# EAGLE design AVEFlex (EAGLE 9.6.2)
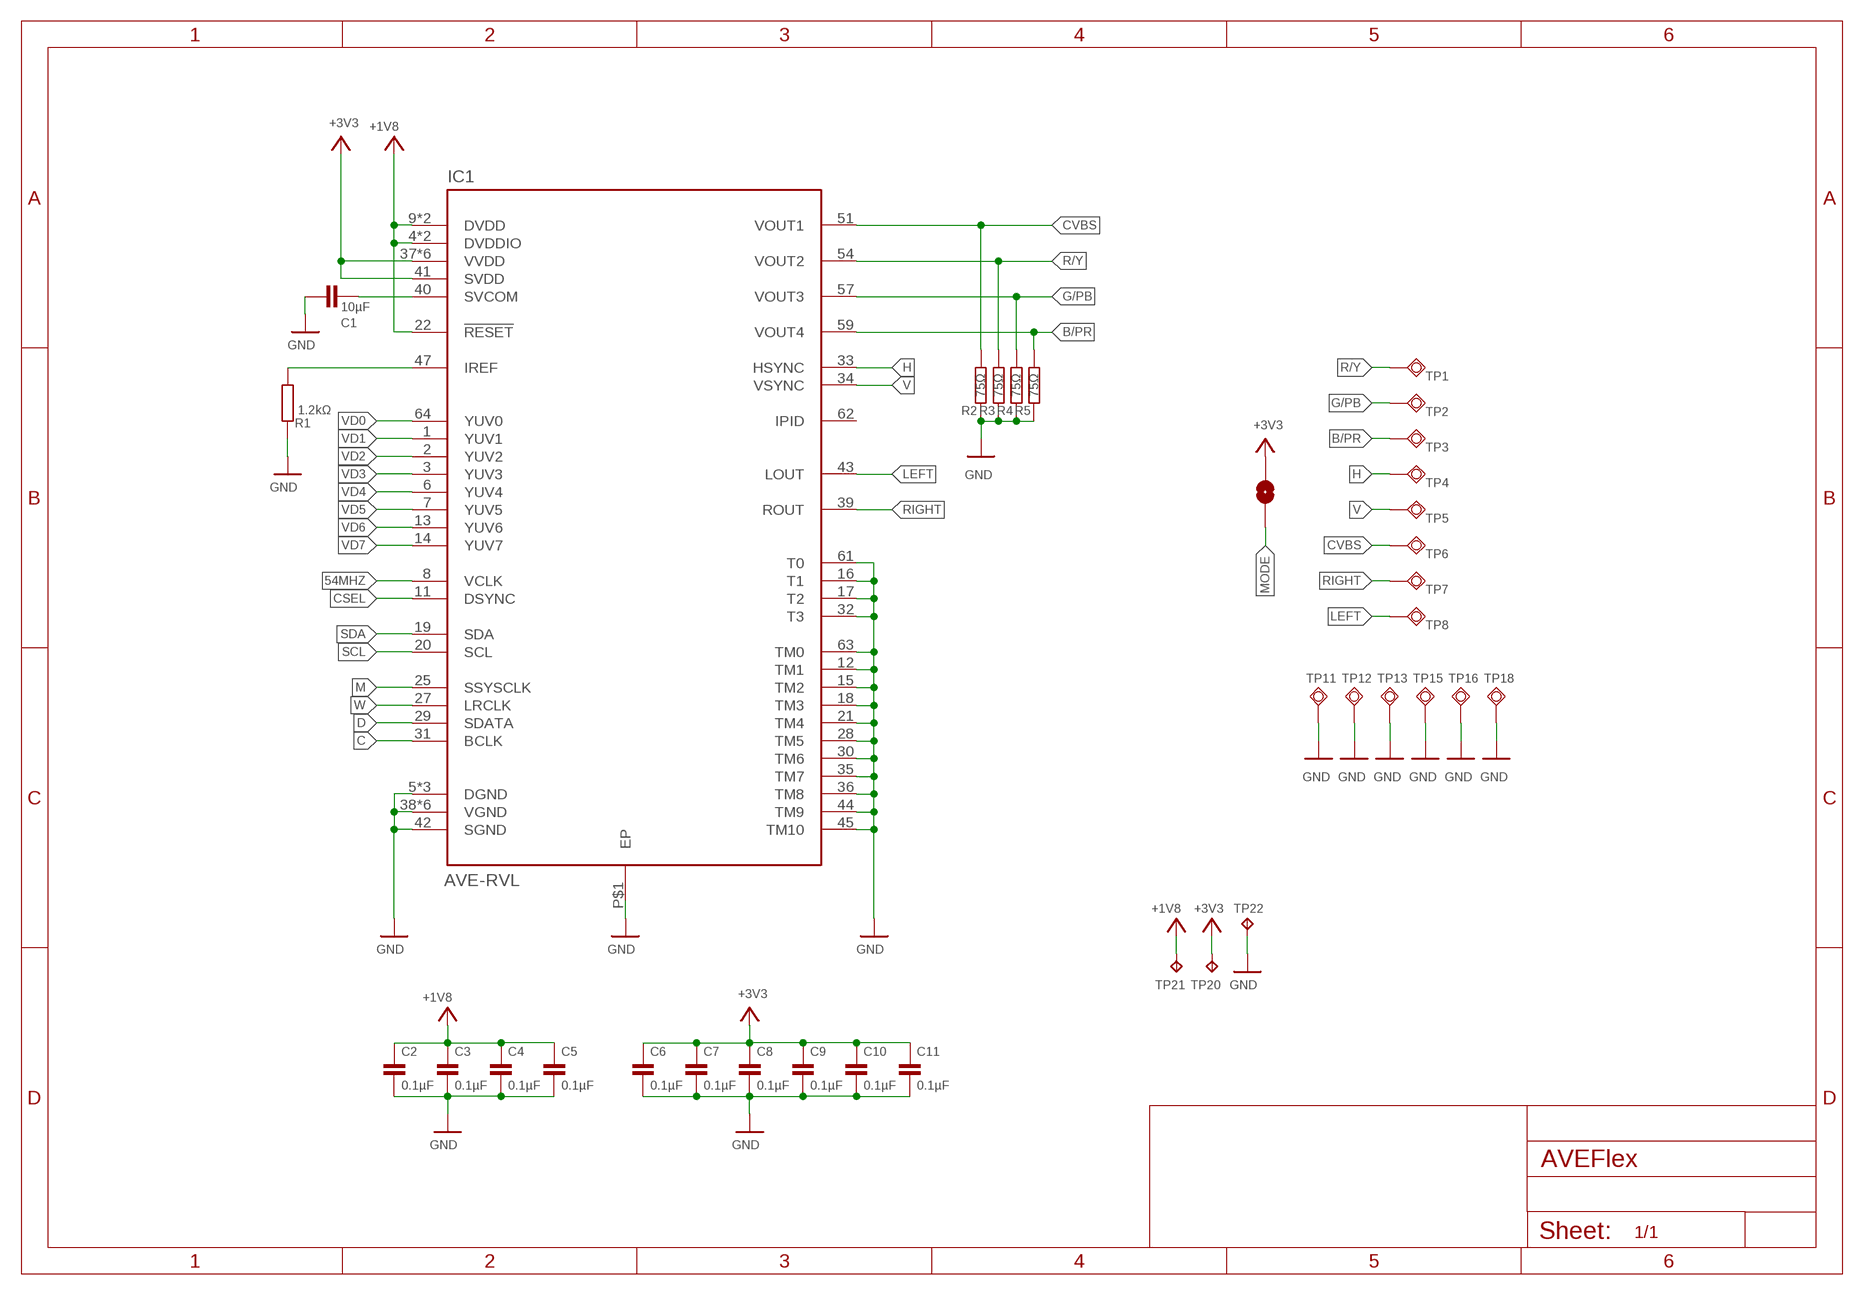
[diagram p0: schematic, sheet 1]

## Parts
C1  10µF  C-USC0603  [C0603]
C2  0.1µF  C-USC0402  [C0402]
C3  0.1µF  C-USC0402  [C0402]
C4  0.1µF  C-USC0402  [C0402]
C5  0.1µF  C-USC0402  [C0402]
C6  0.1µF  C-USC0402  [C0402]
C7  0.1µF  C-USC0402  [C0402]
C8  0.1µF  C-USC0402  [C0402]
C9  0.1µF  C-USC0402  [C0402]
C10  0.1µF  C-USC0402  [C0402]
C11  0.1µF  C-USC0402  [C0402]
IC1  AVE-RVL  AVE  [TQFP64-10X10]
JP1  JUMPER-SMT_2_NO_SILK  [SMT-JUMPER_2_NO_SILK]
R1  1.2kΩ  R-US_R0402  [R0402]
R2  75Ω  R-US_R0402  [R0402]
R3  75Ω  R-US_R0402  [R0402]
R4  75Ω  R-US_R0402  [R0402]
R5  75Ω  R-US_R0402  [R0402]
TP1  TPSQTP10R  [TP10R]
TP2  TPSQTP10R  [TP10R]
TP3  TPSQTP10R  [TP10R]
TP4  TPSQTP10R  [TP10R]
TP5  TPSQTP10R  [TP10R]
TP6  TPSQTP10R  [TP10R]
TP7  TPSQTP10R  [TP10R]
TP8  TPSQTP10R  [TP10R]
TP11  TPSQTP10R  [TP10R]
TP12  TPSQTP10R  [TP10R]
TP13  TPSQTP10R  [TP10R]
TP15  TPSQTP10R  [TP10R]
TP16  TPSQTP10R  [TP10R]
TP18  TPSQTP10R  [TP10R]
TP20  TPTP10SQ  [TP10SQ]
TP21  TPTP10SQ  [TP10SQ]
TP22  TPTP10SQ  [TP10SQ]

## Nets
54MHZ: IC1.8(VCLK)
+1V8: C2.1 C3.1 C4.1 C5.1 IC1.4(DVDDIO) IC1.9(DVDD) IC1.22(!RESET) IC1.23(DVDD) IC1.26(DVDDIO) TP21.TP
+3V3: C6.1 C7.1 C8.1 C9.1 C10.1 C11.1 IC1.37(VVDD) IC1.41(SVDD) IC1.46(VVDD) IC1.50(VVDD) IC1.53(VVDD) IC1.56(VVDD) IC1.60(VVDD) JP1.2 TP20.TP
B/PR: IC1.59(VOUT4) R5.1 TP3.TP
C: IC1.31(BCLK)
CSEL: IC1.11(DSYNC)
CVBS: IC1.51(VOUT1) R2.1 TP6.TP
D: IC1.29(SDATA)
G/PB: IC1.57(VOUT3) R4.1 TP2.TP
GND: C1.2 C2.2 C3.2 C4.2 C5.2 C6.2 C7.2 C8.2 C9.2 C10.2 C11.2 IC1.5(DGND) IC1.10(DGND) IC1.12(TM1) IC1.15(TM2) IC1.16(T1) IC1.17(T2) IC1.18(TM3) IC1.21(TM4) IC1.24(DGND) IC1.28(TM5) IC1.30(TM6) IC1.32(T3) IC1.35(TM7) IC1.36(TM8) IC1.38(VGND) IC1.42(SGND) IC1.44(TM9) IC1.45(TM10) IC1.48(VGND) IC1.49(VGND) IC1.52(VGND) IC1.55(VGND) IC1.58(VGND) IC1.61(T0) IC1.63(TM0) IC1.P$1(EP) R1.2 R2.2 R3.2 R4.2 R5.2 TP11.TP TP12.TP TP13.TP TP15.TP TP16.TP TP18.TP TP22.TP
H: IC1.33(HSYNC) TP4.TP
IREF: IC1.47(IREF) R1.1
LEFT: IC1.43(LOUT) TP8.TP
M: IC1.25(SSYSCLK)
MODE: JP1.1
N$5: C1.1 IC1.40(SVCOM)
R/Y: IC1.54(VOUT2) R3.1 TP1.TP
RIGHT: IC1.39(ROUT) TP7.TP
SCL: IC1.20(SCL)
SDA: IC1.19(SDA)
V: IC1.34(VSYNC) TP5.TP
VD0: IC1.64(YUV0)
VD1: IC1.1(YUV1)
VD2: IC1.2(YUV2)
VD3: IC1.3(YUV3)
VD4: IC1.6(YUV4)
VD5: IC1.7(YUV5)
VD6: IC1.13(YUV6)
VD7: IC1.14(YUV7)
W: IC1.27(LRCLK)
Unconnected: IC1.62(IPID)

## Library data of the parts
C1-C11 = resistor:C-US: CAPACITOR, American symbol
IC1 = ave:AVE
JP1 = SparkFun-Jumpers:JUMPER-SMT_2_NO: Normally open jumper This jumper has two pads in close proximity to each other. Apply solder to close the connection. Round pads are easier to solder for beginners, but are a lot larger. SparkFun Product that uses the round pads: SparkFun EL Sequencer <https://www.sparkfun.com/products/12781>
R1-R5 = resistor:R-US_: RESISTOR, American symbol
TP1-TP8 TP11-TP13 TP15 TP16 TP18 = testpad:TPSQ: Test pad
TP20-TP22 = BeagleBone_Blue_R3:TP: Test pad

## Board
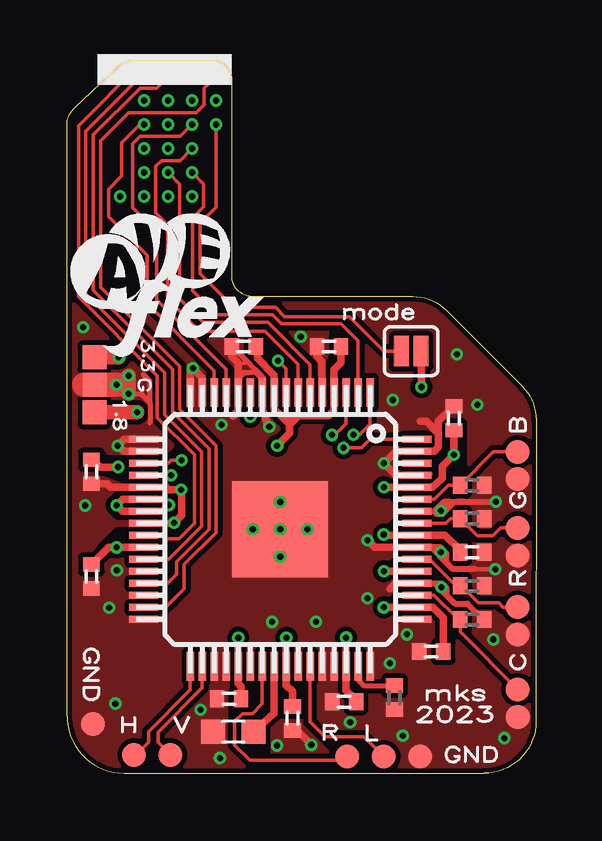
[diagram p1: board, top side]
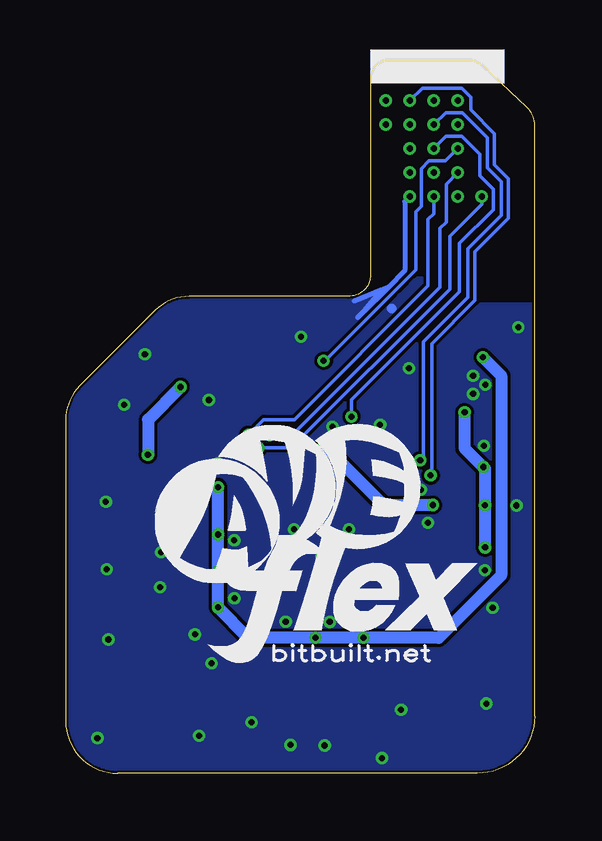
[diagram p2: board, bottom side, seen from below]

Size 19.56 x 29.72 mm. Coordinates in mm from the lower left corner, seen from the top.
Outline: 0,27 arc-47 0.31,27.73
Outline: 2.12,29.44 arc-43 2.81,29.72
Outline: 6.06,29.72 arc-90 6.86,28.92
Outline: 6.86,20.68 arc45 7.07,20.16
Outline: 7.07,20.16 arc45 7.78,19.87
Outline: 14.41,19.87 arc-45 15.83,19.28
Outline: 18.97,16.14 arc-45 19.56,14.72
Outline: 19.56,2.17 arc-90 17.39,0
Outline: 0,2.38 arc90 2.38,0
Outline: 0,27 arc-47 0.31,27.73
Outline: 0.31,27.73 2.12,29.44
Outline: 2.12,29.44 arc-43 2.81,29.72
Outline: 2.81,29.72 6.06,29.72
Outline: 6.06,29.72 arc-90 6.86,28.92
Outline: 6.86,28.92 6.86,23.3 6.86,20.68
Outline: 6.86,20.68 arc45 7.07,20.16
Outline: 7.07,20.16 arc45 7.78,19.87
Outline: 7.78,19.87 14.41,19.87
Outline: 14.41,19.87 arc-45 15.83,19.28
Outline: 15.83,19.28 18.97,16.14
Outline: 18.97,16.14 arc-45 19.56,14.72
Outline: 19.56,14.72 19.56,2.17
Outline: 19.56,2.17 arc-90 17.39,0
Outline: 0,2.38 0,27
Outline: 0,2.38 arc90 2.38,0
Outline: 2.38,0 17.39,0
Copper layers (1*16): Top 0.035mm / dielectric 0.065mm / Bottom 0.035mm
Design rules "default *": minimum track width 6mil, minimum drill 10mil, track to track 5mil, track to pad 5mil, pad to pad 5mil, via to via 5mil, smd to smd 5mil, copper to edge 4mil, drill to drill 5mil, minimum pad ring 4mil, minimum via ring 4mil, stop-mask expansion 0mil, vias tented up to drill 30mil, thermal gap 10mil
tRestrict: area 3.6,9.8 to 5.6,12.6; area 3.3,7.1 to 4.4,8.9; area 7.1,3.5 to 10,4.2; area 14.7,12.9 to 15.9,14.1; area 15,7 to 16.5,12.1; 32 lines

### Footprints (pad centres in the part's own frame; a part is rotated, then mirrored left to right if it is on the bottom)
C0603 = smd 1 x 1: 1 -0.85,0; 2 0.85,0
C0402 = smd 0.6 x 0.7: 1 -0.5,0; 2 0.5,0
TQFP64-10X10 = smd 1.2 x 0.3: 1 -5.7,3.75; 2 -5.7,3.25; 3 -5.7,2.75; 4 -5.7,2.25; 5 -5.7,1.75; 6 -5.7,1.25; 7 -5.7,0.75; 8 -5.7,0.25; 9 -5.7,-0.25; 10 -5.7,-0.75; 11 -5.7,-1.25; 12 -5.7,-1.75; 13 -5.7,-2.25; 14 -5.7,-2.75; 15 -5.7,-3.25; 16 -5.7,-3.75; 33 5.7,-3.75; 34 5.7,-3.25; 35 5.7,-2.75; 36 5.7,-2.25; 37 5.7,-1.75; 38 5.7,-1.25; 39 5.7,-0.75; 40 5.7,-0.25; 41 5.7,0.25; 42 5.7,0.75; 43 5.7,1.25; 44 5.7,1.75; 45 5.7,2.25; 46 5.7,2.75; 47 5.7,3.25; 48 5.7,3.75 | smd 0.3 x 1.2: 17 -3.75,-5.7; 18 -3.25,-5.7; 19 -2.75,-5.7; 20 -2.25,-5.7; 21 -1.75,-5.7; 22 -1.25,-5.7; 23 -0.75,-5.7; 24 -0.25,-5.7; 25 0.25,-5.7; 26 0.75,-5.7; 27 1.25,-5.7; 28 1.75,-5.7; 29 2.25,-5.7; 30 2.75,-5.7; 31 3.25,-5.7; 32 3.75,-5.7; 49 3.75,5.7; 50 3.25,5.7; 51 2.75,5.7; 52 2.25,5.7; 53 1.75,5.7; 54 1.25,5.7; 55 0.75,5.7; 56 0.25,5.7; 57 -0.25,5.7; 58 -0.75,5.7; 59 -1.25,5.7; 60 -1.75,5.7; 61 -2.25,5.7; 62 -2.75,5.7; 63 -3.25,5.7; 64 -3.75,5.7 | smd 4 x 4: P$1 0,0
SMT-JUMPER_2_NO_SILK = smd 0.635 x 1.27: 1 -0.406,0; 2 0.406,0
R0402 = smd 0.6 x 0.7: 1 -0.5,0; 2 0.5,0
TP10R = smd 1 x 1: TP 0,0
TP10SQ = smd 1 x 1: TP 0,0

### Placement (x,y rotation side)
C1  6.93,1.73 180 top
C2  10.92,17.78 180 top
C3  7.37,17.78 180 top
C4  1.02,12.56 270 top
C5  1.02,8.2 270 top
C6  6.76,3.1 180 top
C7  9.4,2.29 270 top
C8  11.55,2.98 180 top
C9  15.19,5.07 180 top
C10  16.89,9.2 0 top
C11  16.13,14.79 90 top
IC1  8.89,10.16 270 top
JP1  14.35,17.58 0 top
R1  13.65,3.15 270 top
R2  16.89,6.41 0 top
R3  16.89,7.81 0 top
R4  16.89,10.6 0 top
R5  16.89,12 0 top
TP1  18.8,6.92 0 top
TP2  18.8,10.22 0 top
TP3  18.8,13.39 0 top
TP4  2.79,0.76 0 top
TP5  4.32,0.76 0 top
TP6  18.8,3.49 0 top
TP7  11.69,0.69 0 top
TP8  13.21,0.69 0 top
TP11  18.8,5.77 0 top
TP12  18.8,9.08 0 top
TP13  18.8,12.25 0 top
TP15  1.08,2.06 0 top
TP16  14.73,0.69 0 top
TP18  18.8,2.34 315 top
TP20  1.14,17.33 0 top
TP21  1.14,15.04 0 top
TP22  1.14,16.19 0 top

### Tracks (layer width: path | path; a pad name or v marks a point on that pad's centre or on a via)
54MHZ  (via drill 0.25 pad 0.51)
  Top 0.152: v8.8,17.18 9.14,16.85 IC1.8
  Bottom 0.152: v3.21,26.03 3.73,25.51 4.41,25.51 4.73,25.2 4.73,23.63 4.96,23.4 4.96,20.97 8.75,17.18 v8.8,17.18
+1V8  (via drill 0.25 pad 0.51)
  Top 0.152: IC1.26
  Top 0.305: C2.1 11.43,17.77 11.43,17.11 11.14,16.82 IC1.4 11.14,15.13 10.9,14.9 9.65,14.9 | C3.1 7.94,17.7 7.94,17.28 8.64,16.59 IC1.9 8.64,15.17 8.91,14.9 | C4.1 1.08,13.06 1.39,12.76 v2.14,12.76 | IC1.26 2.15,9.41 2.11,9.37 v2.07,9.41 1.73,9.41 C5.1 | C5.1 | 9.65,14.9 8.91,14.9 | 8.91,14.9 8.91,14.89 9.27,14.54 | 9.27,14.54 9.27,14.16 v8.76,13.65 | 9.27,14.54 9.29,14.54 9.65,14.9 | IC1.22 2.32,11.41 v2.07,11.16 2.32,10.91 IC1.23 3.98,10.91 v4.24,11.18 4.01,11.41 IC1.22
  Top 0.61: TP21.TP v2.92,15.04
  Bottom 0.305: v2.07,9.41
  Bottom 0.508: v2.92,15.04 2.92,13.54 v2.14,12.76 2.07,12.69 v2.07,11.16 v2.07,9.41 | v4.24,11.18 6.29,11.18 v8.76,13.65
+3V3  (via drill 0.25 pad 0.51)
  Top 0.305: C10.1 16.39,9.28 15.77,9.91 IC1.56 13.24,9.91 v13.2,9.95 | C7.1 9.4,3.41 9.14,3.67 IC1.41 v9.14,5.64 v9.15,5.65 | v11.64,5.65 IC1.46 11.64,3.47 12.05,3.05 C8.1 | v11.64,5.65 | v7.14,5.64 IC1.37 7.14,3.74 7.26,3.63 C6.1 | JP1.2 14.77,17.57 v14.77,16.09 | C11.1 v16.13,13.27 15.65,12.79 15.65,12.29 15.23,11.91 IC1.60 13.22,11.91 v13.21,11.92 | C9.1 15.7,6.47 15.26,6.91 IC1.50 v13.21,6.91 | IC1.53 v13.21,8.41 v13.21,8.42
  Top 0.61: TP20.TP v2.16,17.33
  Bottom 0.305: 4.13,5.64 v7.14,5.64 | v11.64,5.65 v9.15,5.65 | v13.21,9.94 v13.2,9.95 | v13.2,11.92 v13.21,11.92
  Bottom 0.508: v2.16,17.33 1.4,16.57 1.4,8.24 4,5.64 v7.14,5.64 v7.15,5.65 v9.15,5.65 | v9.15,5.65 v11.64,5.65 11.95,5.65 v13.21,6.91 v13.21,8.41 v13.21,8.42 v13.21,9.94 | v13.2,9.95 v13.2,11.92 | v14.77,16.09 16.13,14.73 v16.13,13.27
B/PR
  Top 0.152: IC1.59 15.32,11.41 15.9,12 R5.1 16.39,12.01 17.78,13.39 TP3.TP
C  (via drill 0.25 pad 0.51)
  Top 0.152: v6.21,29.03 5.71,28.54 5.71,27.85 5.39,27.53 2.56,27.53 1.4,26.36 1.4,20.25 4.7,16.95 4.7,15.17 6.22,13.65 6.22,10.03 4.89,8.7 4.89,7.69 4.12,6.91 IC1.31
CSEL  (via drill 0.25 pad 0.51)
  Top 0.152: IC1.11 v7.64,14.86
  Bottom 0.152: v4.21,26.03 3.7,26.54 3.04,26.54 2.29,25.79 2.29,24.89 1.73,24.33 1.73,23.48 3.13,22.07 3.13,20.06 7.64,15.55 v7.64,14.86
CVBS
  Top 0.152: IC1.51 15.31,7.41 16.31,6.41 R2.1 16.39,5.89 TP6.TP 18.61,3.49
D  (via drill 0.25 pad 0.51)
  Top 0.152: IC1.29 4.19,7.91 4.57,8.29 4.57,8.81 5.92,10.16 5.92,13.45 5.92,13.52 4.4,15.05 4.4,16.82 1.09,20.13 1.09,26.6 3.04,28.55 3.73,28.55 v4.21,29.03
G/PB
  Top 0.152: TP2.TP 18.09,10.22 17.76,9.89 17.1,9.89 R4.1 16.45,10.54 arc45 16.31,10.6 15.98,10.6 15.79,10.41 IC1.57
GND  (via drill 0.25 pad 0.51)
  Top 0.152: 7.14,17.08 7.6,17.08 7.87,16.81 8.14,16.54
  Top 0.203: IC1.10 8.14,16.54 | 7.98,16.7 7.87,16.81 7.48,17.2 7.47,17.2 6.96,17.71 6.87,17.71 | 8.14,16.54 7.98,16.7 | 7.98,16.7 7.62,16.7 | 7.62,16.7 7.6,16.7 | 7.6,16.7 7.14,16.7 | IC1.10 8.09,15.91 8.09,16.48 7.88,16.69 7.63,16.69 7.62,16.7 | IC1.10 8.19,15.91 8.19,16.49 8.14,16.54 | 7.6,16.7 7.59,16.69 7.4,16.69 7.14,16.43 IC1.12 | v2.57,15.8 3.08,15.8 3.46,15.43 | 3.46,15.43 3.46,14.58 | 3.46,15.43 3.46,16.34 3.18,16.61 | 16.77,8.53 v17.85,8.49
  Top 0.254: IC1.58 15.31,10.91 | 15.31,10.91 15.32,10.91 | 15.41,11 15.32,10.91 | 15.41,11 15.79,11 15.95,11.16 | 16.26,11.31 16.09,11.31 15.95,11.16 | 16.59,11.31 16.26,11.31 | IC1.55 15.19,9.41 15.83,8.77 | 16.98,8.53 16.77,8.53 16.07,8.53 15.91,8.69 | 15.83,8.77 15.89,8.71 | 15.33,7.91 IC1.52 15.45,7.91 v15.61,7.75 | R2.2 17.36,6.41 16.7,7.06 16.18,7.06 15.82,7.42 | 15.33,7.91 15.82,7.42 | 16.26,11.31 | 16.26,11.31 v17.88,11.31 | IC1.55 15.39,9.41 v15.58,9.21 | IC1.55 15.5,9.41 | 15.83,8.77 15.83,9.15 15.7,9.28 | 15.7,9.28 15.6,9.38 | v15.58,9.21 15.63,9.21 15.7,9.28 | v15.58,9.21 15.58,9.41 15.05,9.41 | v15.61,7.75 15.82,7.55 15.82,7.42 | 15.33,7.91 15.63,7.91 15.8,7.74 | v15.61,7.75 15.79,7.75 15.82,7.72 15.82,7.42 | 15.32,10.91 15.32,10.9 15.42,10.81 15.65,10.81 15.95,11.1 | 15.95,11.16 15.95,11.1 | 15.95,11.1 16.15,11.31 | 16.15,11.31 16.26,11.31 | v15.58,10.94 15.96,11.31 | 15.96,11.31 16.15,11.31 | 15.95,11.1 15.51,11.1 15.41,11 | 15.96,11.31 15.71,11.31 15.31,10.91
  Top 0.305: IC1.5 10.63,17.15 10.42,17.37 C2.2 | C3.2 6.87,17.71 6.87,17.38 7.14,17.11 7.14,17.08 7.14,16.7 IC1.12 7.14,15.09 6.92,14.87 | v10.18,1.18 9.58,1.79 C7.2 | C4.2 1.67,12.06 1.82,11.91 IC1.21 4.13,11.91 4.22,11.82 v4.75,11.82 4.78,11.79 4.78,10.76 v4.46,10.43 4.43,10.41 IC1.24 | IC1.17 2.38,13.91 v2.11,13.65 2.35,13.41 IC1.18 | 8.96,10.16 IC1.P$1 | IC1.16 5.14,16.76 v5.25,16.87 5.64,16.48 IC1.15 | 8.43,14.55 v8.43,14.43 8.37,14.49 8.14,15.15 IC1.10 | IC1.55 12.83,9.41 v12.53,9.71 | IC1.61 13.72,12.41 v13.22,12.91 13.71,13.41 IC1.63 15.31,13.41 15.5,13.6 15.5,14.15 | C11.2 15.5,14.66 15.5,14.15 | IC1.52 13.69,7.91 13.46,7.68 | 15.5,14.15 14.98,14.66 14.73,14.66
  Top 0.61: v2.06,16.18 TP22.TP | v2.06,16.18 v2.57,16.57 v2.57,15.8 v2.06,16.18
  Top 1.016: v2.06,16.18 v2.06,16.19 TP22.TP 0.72,16.19
  Bottom 0.203: v5.21,24.03 5.42,23.83 5.42,20.95 6.11,20.26 | 6.11,20.26 7.25,19.12 | 7.25,19.12 7.39,18.98 | 6.11,20.26 6.41,20.13 | 6.41,20.13 7.52,19.67 | 6.41,20.13 7.25,19.12
  Bottom 0.406: 5.97,19.37 5.97,19.36
  other vias: 8.89,10.16 8.89,11.3 10.03,10.16 8.89,9.02 7.75,10.16 1.75,6.89 11.81,2.13 5.57,2.65 17.12,15.35 0.76,11.16 9.74,18.19 6.45,14.52 17.78,5.57 14.17,5.78 6.37,0.63 8.55,6.3 10.38,6.32 12.52,7.29 2.02,2.9 16.26,17.46 14,1.57 18.23,1.47 2.08,8.46 8.76,1.16 0.68,18.59 13.59,15.55 13.47,4.58
  pour Bottom (no thermals): -1,19.55 -1,-0.52 19.56,-0.52 19.56,16.17 15.73,20 7.88,20 7.75,19.87 5.08,19.87 4.76,19.55
  pour Bottom (no thermals): -1,19.55 -1,-0.52 19.56,-0.52 19.56,16.17 15.73,20 7.88,20 7.75,19.87 5.08,19.87 4.76,19.55
  pour Top (isolate 0.203, no thermals): -1,19.55 -1,-0.52 19.56,-0.52 19.56,16.17 15.73,20 7.88,20 7.75,19.87 5.08,19.87 4.76,19.55
  pour Bottom (no thermals): 5.75,19.9 5.45,20.16 5.04,20.6 4.91,20.69 4.76,20.71 4.66,20.68 4.6,20.56 arc37 4.79,20.21 5.36,19.7 5.75,19.89
H
  Top 0.152: IC1.33 5.14,3.48 3.39,1.74 3.39,1.3 2.86,0.76 TP4.TP
IREF
  Top 0.203: IC1.47 | IC1.47 12.14,3.9 12.41,3.63 13.63,3.63 R1.1
LEFT
  Top 0.152: TP8.TP 12.38,1.53 10.75,1.53 10.14,2.14 IC1.43
M  (via drill 0.25 pad 0.51)
  Top 0.152: v5.21,29.03 4.73,29.51 3.01,29.51 0.48,26.99 0.48,19.85 3.76,16.57 3.76,14.82 5.31,13.27 5.31,13.2 5.31,10.41 4.67,9.78 4.17,9.78 4.04,9.91 IC1.25
MODE  (via drill 0.25 pad 0.51)
  Top 0.152: v6.21,27.03 6.21,23.58 5.56,22.93 5.56,20.8 6.95,19.41 8.69,19.41 9.08,19.02 11.77,19.02 13.21,17.58 JP1.1
N$5
  Top 0.305: IC1.40 8.64,2.51 C1.1
N$8  (via drill 0.25 pad 0.51)
  other vias: 6.21,28.03
N$11  (via drill 0.25 pad 0.51)
  other vias: 4.21,28.03
N$12  (via drill 0.25 pad 0.51)
  other vias: 3.21,28.03
N$22  (via drill 0.25 pad 0.51)
  other vias: 3.21,24.03
R/Y
  Top 0.152: IC1.54 15.11,8.91 16.21,7.81 R3.1 16.44,7.81 17.15,7.09 18.01,7.09 18.18,6.92 TP1.TP
RIGHT
  Top 0.152: IC1.39 8.14,3.32 8.14,2.89 7.74,2.49 7.31,2.49 6.99,2.17 6.99,1.17 7.63,0.54 11.53,0.54 TP7.TP
SCL  (via drill 0.25 pad 0.51)
  Top 0.152: v4.34,12.41 IC1.20
  Bottom 0.152: v4.34,12.41 4.29,12.46 4.29,17.9 2.49,19.7 2.49,21.72 1.09,23.11 1.09,24.76 1.68,25.35 1.68,26.64 2.67,27.64 2.67,28.17 3.04,28.55 4.69,28.55 v5.21,28.03
SDA  (via drill 0.25 pad 0.51)
  Top 0.152: v4.78,13.04 4.35,13.04 4.22,12.91 IC1.19
  Bottom 0.152: v4.78,13.04 4.65,13.16 4.65,17.98 2.79,19.83 2.79,21.85 1.4,23.24 1.4,24.64 1.98,25.22 1.98,26.49 3.02,27.53 3.71,27.53 v4.21,27.03
V
  Top 0.152: TP5.TP 3.79,1.29 3.79,1.7 5.64,3.55 IC1.34
VD0  (via drill 0.25 pad 0.51)
  Top 0.152: IC1.64 12.64,13.91 12.28,13.55 v11.52,13.55
  Bottom 0.152: v11.52,13.55 10.15,13.55 3.54,20.17 3.54,22.38 2.21,23.71 v2.21,24.03
VD1  (via drill 0.25 pad 0.51)
  Top 0.152: IC1.1 12.64,14.54 12.19,14.1 v11.94,14.1
  Bottom 0.152: v11.94,14.1 11.3,14.73 10.03,14.73 4.44,20.31 4.44,23.08 4.21,23.31 v4.21,24.03
VD2  (via drill 0.25 pad 0.51)
  Top 0.152: IC1.2 12.14,18.01 11.43,18.72 8.94,18.72 8.57,19.1 6.22,19.1 5.23,20.09 5.23,23.13 5.69,23.6 5.69,24.55 v5.21,25.03
VD3  (via drill 0.25 pad 0.51)
  Top 0.152: IC1.3 11.64,14.56 11.18,14.1 v11.05,14.1
  Bottom 0.152: v3.21,25.03 3.69,24.55 3.69,22.96 3.94,22.71 3.94,20.26 10.11,14.1 10.48,14.1 | 10.48,14.1 | 10.48,14.1 v11.05,14.1
VD4  (via drill 0.25 pad 0.51)
  Top 0.152: IC1.6 10.14,17.03 8.37,18.8 5.67,18.8 4.7,19.76 4.7,24.54 v4.21,25.03
VD5  (via drill 0.25 pad 0.51)
  Top 0.152: IC1.7 9.64,17.04 8.26,18.41 5.53,18.41 4.19,19.76 4.19,22.86 3.7,23.36 3.7,25.29 3.94,25.53 4.7,25.53 v5.21,26.03
VD6  (via drill 0.25 pad 0.51)
  Top 0.152: IC1.13 6.64,16.82 3.73,19.74 3.73,22.56 2.73,23.56 2.73,26.23 3.04,26.54 4.72,26.54 v5.21,27.03
VD7  (via drill 0.25 pad 0.51)
  Top 0.152: IC1.14 6.14,16.78 3.35,19.57 3.35,21.58 1.73,23.2 1.73,24.33 2.29,24.89 2.29,26.26 3.06,27.03 v3.21,27.03
W  (via drill 0.25 pad 0.51)
  Top 0.152: v3.21,29.03 3.07,29.03 0.79,26.75 0.79,19.97 4.07,16.7 4.07,14.94 5.61,13.4 5.61,10.28 4.24,8.91 IC1.27